# Altium schematic sheet sensor_hub_mcu.SchDoc
size A4
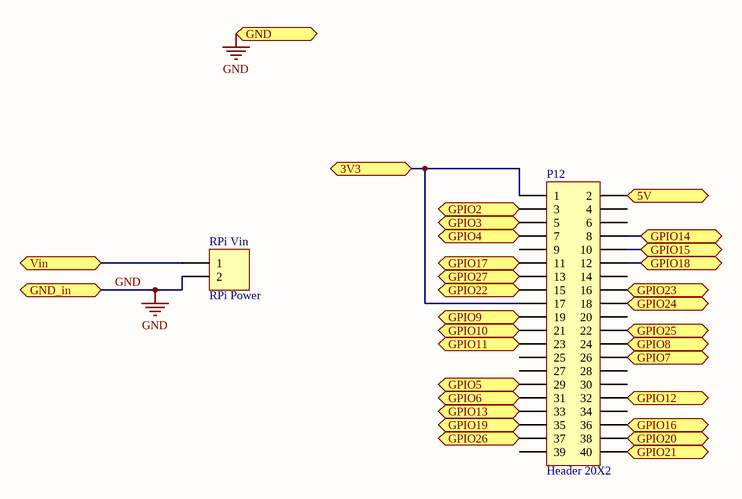
[diagram p0: sensor_hub_mcu.SchDoc]

## Parts
P12  Header 20X2  [HDR2X20]
RPi_Vin  RPi Power  [HDR1X2]

## Ports
3V3 (bidir), 5V (bidir), GND (bidir), GND_in (bidir), GPIO2 (bidir), GPIO3 (bidir), GPIO4 (bidir), GPIO5 (bidir), GPIO6 (bidir), GPIO7 (bidir), GPIO8 (bidir), GPIO9 (bidir), GPIO10 (bidir), GPIO11 (bidir), GPIO12 (bidir), GPIO13 (bidir), GPIO14 (bidir), GPIO15 (bidir), GPIO16 (bidir), GPIO17 (bidir), GPIO18 (bidir), GPIO19 (bidir), GPIO20 (bidir), GPIO21 (bidir), GPIO22 (bidir), GPIO23 (bidir), GPIO24 (bidir), GPIO25 (bidir), GPIO26 (bidir), GPIO27 (bidir), Vin (bidir)

## Nets
GND: RPi_Vin.2 ; port GND, port GND_in
3V3: P12.1 P12.17 ; port 3V3
5V: P12.2 ; port 5V
GPIO2: P12.3 ; port GPIO2
GPIO3: P12.5 ; port GPIO3
GPIO4: P12.7 ; port GPIO4
GPIO5: P12.29 ; port GPIO5
GPIO6: P12.31 ; port GPIO6
GPIO7: P12.26 ; port GPIO7
GPIO8: P12.24 ; port GPIO8
GPIO9: P12.19 ; port GPIO9
GPIO10: P12.21 ; port GPIO10
GPIO11: P12.23 ; port GPIO11
GPIO12: P12.32 ; port GPIO12
GPIO13: P12.33 ; port GPIO13
GPIO14: P12.8 ; port GPIO14
GPIO15: P12.10 ; port GPIO15
GPIO16: P12.36 ; port GPIO16
GPIO17: P12.11 ; port GPIO17
GPIO18: P12.12 ; port GPIO18
GPIO19: P12.35 ; port GPIO19
GPIO20: P12.38 ; port GPIO20
GPIO21: P12.40 ; port GPIO21
GPIO22: P12.15 ; port GPIO22
GPIO23: P12.16 ; port GPIO23
GPIO24: P12.18 ; port GPIO24
GPIO25: P12.22 ; port GPIO25
GPIO26: P12.37 ; port GPIO26
GPIO27: P12.13 ; port GPIO27
Vin: RPi_Vin.1 ; port Vin

Not connected (* = marked no-connect by the designer): P12 4 6 9 14 20 25 27 28 30 34 39

## Library data of the parts
P12 = Header 20X2: GPIO shield for RPi; LatestRevisionDate: 17-Jul-2002; LatestRevisionNote: Re-released for DXP Platform.; Publisher: Altium Limited
RPi_Vin = Header 2: Power Pins; LatestRevisionDate: 17-Jul-2002; LatestRevisionNote: Re-released for DXP Platform.; Publisher: Altium Limited